# EAGLE schematic piezo-preamp-tickler_V2-RevX (EAGLE 8.3.2)

## Sheet 1 of 2
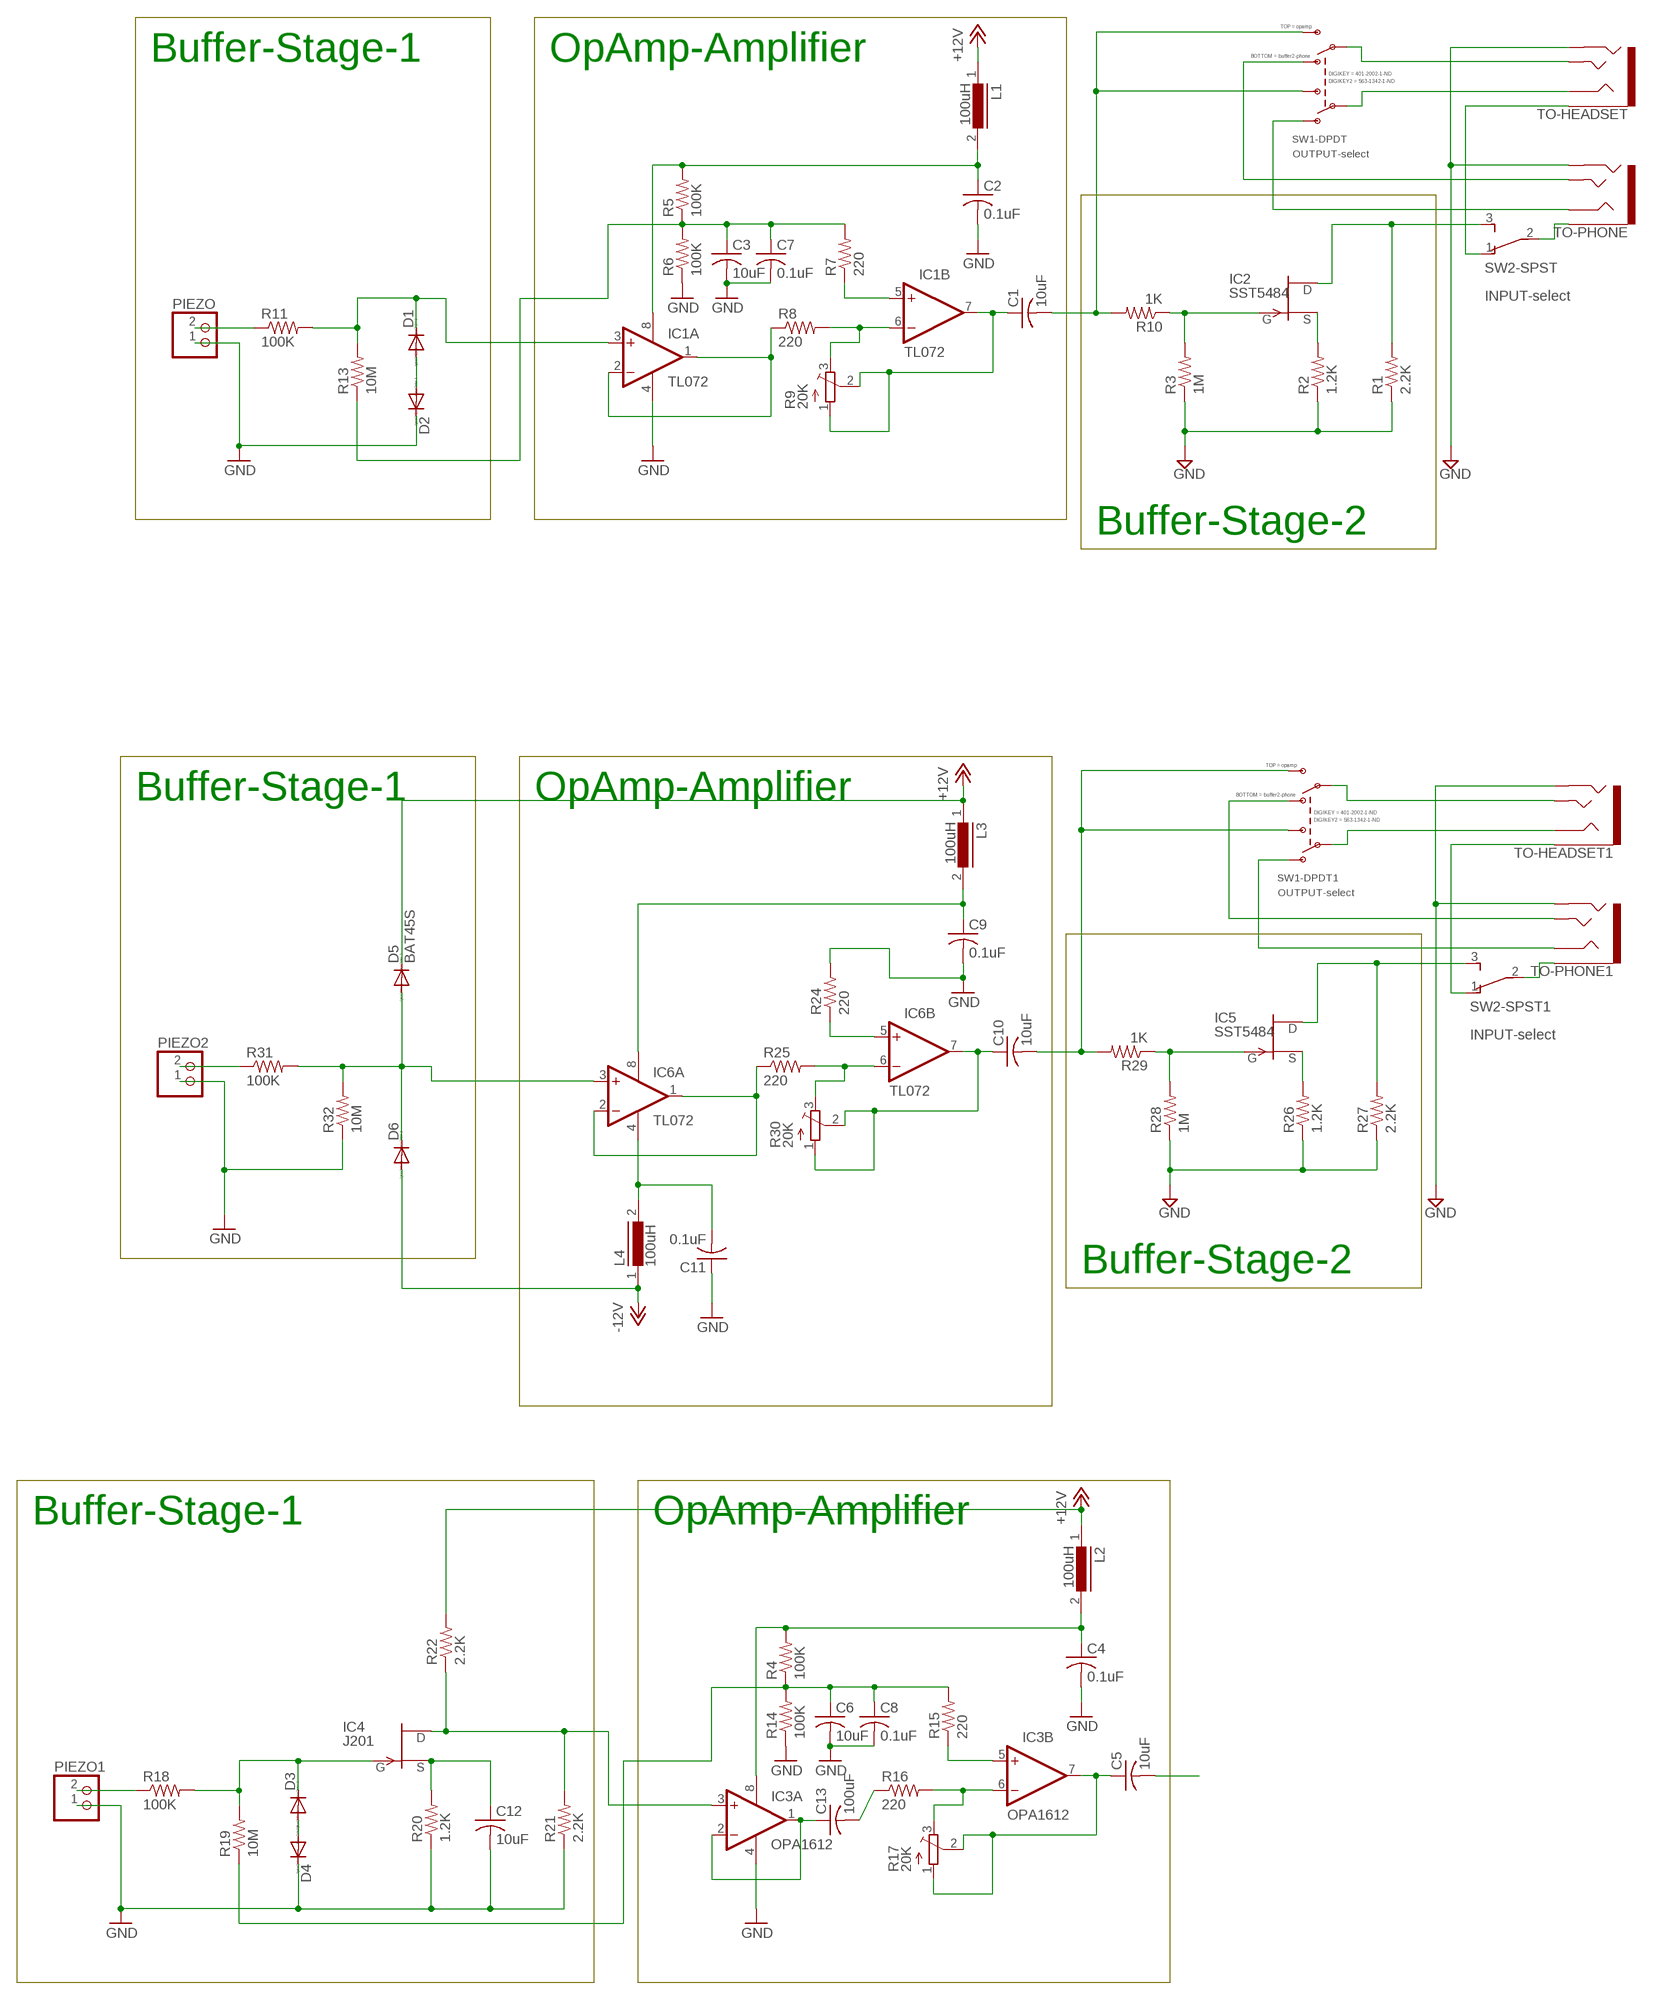
[diagram p0: schematic, sheet 1]

### Parts
C1  10uF  C-USC0805K  [C0805K]
C2  0.1uF  C-USC0805K  [C0805K]
C3  10uF  C-USC0805K  [C0805K]
C4  0.1uF  C-USC0805K  [C0805K]
C5  10uF  C-USC0805K  [C0805K]
C6  10uF  C-USC0805K  [C0805K]
C7  0.1uF  C-USC0805K  [C0805K]
C8  0.1uF  C-USC0805K  [C0805K]
C9  0.1uF  C-USC0805K  [C0805K]
C10  10uF  C-USC0805K  [C0805K]
C11  0.1uF  C-USC0805K  [C0805K]
C12  10uF  C-USC0805K  [C0805K]
C13  100uF  C-USC0805K  [C0805K]
D1  DIODE-SOD123  [SOD123]
D2  DIODE-SOD123  [SOD123]
D3  DIODE-SOD123  [SOD123]
D4  DIODE-SOD123  [SOD123]
D5  BAT45S  DIODE-SOD123  [SOD123]
D6  DIODE-SOD123  [SOD123]
IC1  TL072  OPA2134UA  [SO08]
IC2  SST5484  [SOT23]
IC3  OPA1612  OPA2134UA  [SO08]
IC4  J201  SST5484  [SOT23]
IC5  SST5484  [SOT23]
IC6  TL072  OPA2134UA  [SO08]
L1  100uH  LBC-SE  [LBC-SE]
L2  100uH  LBC-SE  [LBC-SE]
L3  100uH  LBC-SE  [LBC-SE]
L4  100uH  LBC-SE  [LBC-SE]
PIEZO  JST_2PIN-THM  [JST-PH-2-THM]
PIEZO1  JST_2PIN-THM  [JST-PH-2-THM]
PIEZO2  JST_2PIN-THM  [JST-PH-2-THM]
R1  2.2K  R-US_R0603  [R0603]
R2  1.2K  R-US_R0603  [R0603]
R3  1M  R-US_R0603  [R0603]
R4  100K  R-US_R0603  [R0603]
R5  100K  R-US_R0603  [R0603]
R6  100K  R-US_R0603  [R0603]
R7  220  R-US_R0603  [R0603]
R8  220  R-US_R0603  [R0603]
R9  20K  TRIMPOTTC33X  [TC33X]
R10  1K  R-US_R0603  [R0603]
R11  100K  R-US_R0603  [R0603]
R13  10M  R-US_R0603  [R0603]
R14  100K  R-US_R0603  [R0603]
R15  220  R-US_R0603  [R0603]
R16  220  R-US_R0603  [R0603]
R17  20K  TRIMPOTTC33X  [TC33X]
R18  100K  R-US_R0603  [R0603]
R19  10M  R-US_R0603  [R0603]
R20  1.2K  R-US_R0603  [R0603]
R21  2.2K  R-US_R0603  [R0603]
R22  2.2K  R-US_R0603  [R0603]
R24  220  R-US_R0603  [R0603]
R25  220  R-US_R0603  [R0603]
R26  1.2K  R-US_R0603  [R0603]
R27  2.2K  R-US_R0603  [R0603]
R28  1M  R-US_R0603  [R0603]
R29  1K  R-US_R0603  [R0603]
R30  20K  TRIMPOTTC33X  [TC33X]
R31  100K  R-US_R0603  [R0603]
R32  10M  R-US_R0603  [R0603]
SW1-DPDT  OUTPUT-select  SWITCH_DPDT  [DPDT_SMT_JS202011SCQN]
SW1-DPDT1  OUTPUT-select  SWITCH_DPDT  [DPDT_SMT_JS202011SCQN]
SW2-SPST  INPUT-select  SWITCH_SPDTTE-CONNECT  [SWITCH_SPDT-TE-CONNECT]
SW2-SPST1  INPUT-select  SWITCH_SPDTTE-CONNECT  [SWITCH_SPDT-TE-CONNECT]
TO-HEADSET  AUDIO-JACK3LGPADS  [AUDIO-JACK-TRRS-SMD]
TO-HEADSET1  AUDIO-JACK3LGPADS  [AUDIO-JACK-TRRS-SMD]
TO-PHONE  AUDIO-JACK3LGPADS  [AUDIO-JACK-TRRS-SMD]
TO-PHONE1  AUDIO-JACK3LGPADS  [AUDIO-JACK-TRRS-SMD]

### Nets
+12V: D5.C L1.1 L2.1 L3.1 R22.2 ; also sheet 2
-12V: D6.A L4.1
GND: C2.2 C3.2 C4.2 C6.2 C7.2 C8.2 C9.2 C11.1 C12.2 D2.C D4.C IC1.4(A:V-) IC3.4(A:V-) PIEZO1.1 PIEZO2.1 PIEZO.1 R1.1 R2.1 R3.1 R6.1 R14.1 R20.1 R21.1 R24.2 R26.1 R27.1 R28.1 R32.1 TO-HEADSET1.RING2 TO-HEADSET.RING2 TO-PHONE1.RING2 TO-PHONE.RING2 ; also sheet 2
N$1: C13.1 IC3.1(A:OUT) IC3.2(A:-IN)
N$2: PIEZO.2 R11.1
N$3: IC2.2(S) R2.2
N$5: IC1.5(B:+IN) R7.1
N$6: C2.1 IC1.8(A:V+) L1.2 R5.2
N$7: IC1.6(B:-IN) R8.2 R9.3(E)
N$8: D1.A D2.A
N$9: D1.C IC1.3(A:+IN) R11.2 R13.2
N$10: IC2.3(G) R3.2 R10.1
N$11: C1.2 R10.2 SW1-DPDT.P$3(S1) SW1-DPDT.P$4(S2)
N$12: SW2-SPST.1 TO-HEADSET.EARTH
N$13: SW1-DPDT.P$5(P2) TO-HEADSET.TIP
N$14: IC1.1(A:OUT) IC1.2(A:-IN) R8.1
N$15: SW1-DPDT.P$2(P1) TO-HEADSET.RING1
N$16: IC3.5(B:+IN) R15.1
N$17: SW2-SPST.2 TO-PHONE.EARTH
N$22: IC3.6(B:-IN) R16.2 R17.3(E)
N$23: C5.2
N$24: PIEZO1.2 R18.1
N$25: IC3.3(A:+IN) IC4.1(D) R21.2 R22.1
N$26: SW1-DPDT.P$1(O1) TO-PHONE.RING1
N$27: SW1-DPDT.P$6(O2) TO-PHONE.TIP
N$28: C3.1 C7.1 R5.1 R6.2 R7.2 R13.1
N$29: D3.A D4.A
N$30: IC5.2(S) R26.2
N$31: C5.1 IC3.7(B:OUT) R17.1(A) R17.2(S)
N$32: C4.1 IC3.8(A:V+) L2.2 R4.2
N$33: C12.1 IC4.2(S) R20.2
N$34: IC6.1(A:OUT) IC6.2(A:-IN) R25.1
N$35: C6.1 C8.1 R4.1 R14.2 R15.2 R19.1
N$36: D3.C IC4.3(G) R18.2 R19.2
N$37: IC6.5(B:+IN) R24.1
N$38: IC6.6(B:-IN) R25.2 R30.3(E)
N$39: IC5.3(G) R28.2 R29.1
N$41: C1.1 IC1.7(B:OUT) R9.1(A) R9.2(S)
N$42: C10.2 R29.2 SW1-DPDT1.P$3(S1) SW1-DPDT1.P$4(S2)
N$43: SW2-SPST1.1 TO-HEADSET1.EARTH
N$44: SW1-DPDT1.P$5(P2) TO-HEADSET1.TIP
N$45: SW1-DPDT1.P$2(P1) TO-HEADSET1.RING1
N$46: SW2-SPST1.2 TO-PHONE1.EARTH
N$47: PIEZO2.2 R31.1
N$48: SW1-DPDT1.P$1(O1) TO-PHONE1.RING1
N$49: SW1-DPDT1.P$6(O2) TO-PHONE1.TIP
N$50: C11.2 IC6.4(A:V-) L4.2
N$52: C13.2 R16.1
N$53: C10.1 IC6.7(B:OUT) R30.1(A) R30.2(S)
N$54: C9.1 IC6.8(A:V+) L3.2
N$55: D5.A D6.C IC6.3(A:+IN) R31.2 R32.2
SELECT: IC2.1(D) R1.2 SW2-SPST.3
SELECT1: IC5.1(D) R27.2 SW2-SPST1.3

### Notes on the sheet
- Buffer-Stage-1 | OpAmp-Amplifier
- Buffer-Stage-2
- Buffer-Stage-1 | OpAmp-Amplifier
- Buffer-Stage-2
- Buffer-Stage-1 | OpAmp-Amplifier

## Sheet 2 of 2
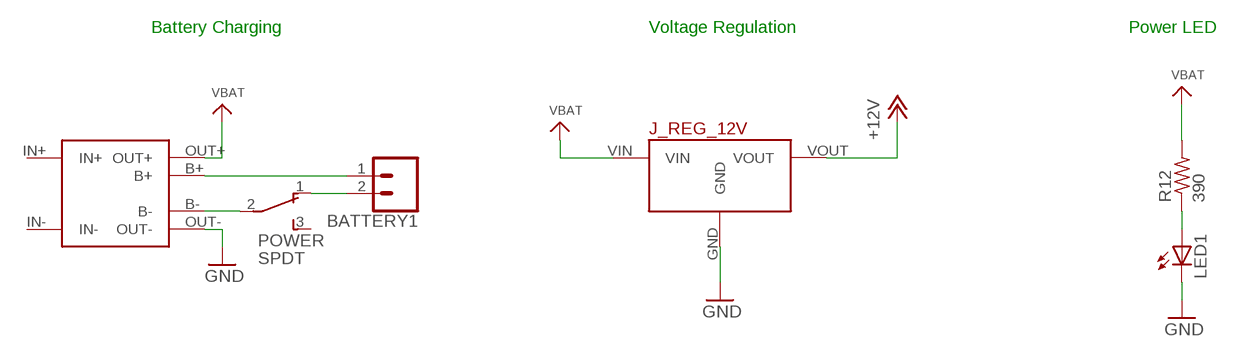
[diagram p1: schematic, sheet 2]

### Parts
BATTERY1  CONN_02LOCK  [1X02_LOCK]
J_REG_12V  POLOLU_VOLTAGE_REGULATORS_3PIN  [POLOLU_5V-12V_STEPUP_U3V12F5-U3V12F12]
LED1  LED3MM  [LED3MM]
POWER  SPDT  SWITCH_SPDTTE-CONNECT  [SWITCH_SPDT-TE-CONNECT]
R12  390  R-US_R0805  [R0805]
USB-LIPO-CHARGER  TP4056-MODULE  [TP4056-LITHIUM-PROTECTED-MODULE]

### Nets
+12V: J_REG_12V.VOUT ; also sheet 1
GND: J_REG_12V.GND LED1.K(C) USB-LIPO-CHARGER.OUT- ; also sheet 1
N$18: LED1.A R12.1
N$19: BATTERY1.1 USB-LIPO-CHARGER.B+
N$20: POWER.2 USB-LIPO-CHARGER.B-
N$21: BATTERY1.2 POWER.1
VBAT: J_REG_12V.VIN R12.2 USB-LIPO-CHARGER.OUT+
Unconnected: POWER.3

### Notes on the sheet
- Battery Charging | Voltage Regulation | Power LED

## Power pins joined to a net without a drawn wire
IN+: USB-LIPO-CHARGER.IN+
IN-: USB-LIPO-CHARGER.IN-

## Library data of the parts
BATTERY1 = SparkFun-Connectors:CONN_02: Multi connection point. Often used as Generic Header-pin footprint for 0.1 inch spaced/style header connections On any of the 0.1 inch spaced packages, you can populate with these: Break Away Headers - Straight <https://www.sparkfun.com/products/116> (PRT-00116) Break Away Male Headers - Right Angle <https://www.sparkfun.com/products/553> (PRT-00553) Female Headers <https://www.sparkfun.com/products/115> (PRT-00115) Break Away Headers - Machine Pin <https://www.sparkfun.com/products/117> (PRT-00117) Break Away Female Headers - Swiss Machine Pin <https://www.sparkfun.com/products/743> (PRT-00743) For SCREWTERMINALS and SPRING TERMINALS visit here: Screw Terimnals on SparkFun.com <https://www.sparkfun.com/search/results?term=Screw+Terminals> (5mm/3.5mm/2.54mm spacing) This device is also useful as a general connection point to wire up your design to another part of your project. Our various solder wires solder well into these plated through hole pads. Hook-Up Wire - Assortment (Stranded, 22 AWG) <https://www.sparkfun.com/products/11375> (PRT-11375) Hook-Up Wire - Assortment (Solid Core, 22 AWG) <https://www.sparkfun.com/products/11367> (PRT-11367) View the entire wire category on our website here <https://www.sparkfun.com/categories/141> Special notes: Molex polarized connector foot print use with: PRT-08233 with associated crimp pins and housings. 2.54_SCREWTERM for use with PRT-10571. 3.5mm Screw Terminal footprints for PRT-08084 5mm Screw Terminal footprints for use with PRT-08432
C1-C13 = adafruit:C-US: CAPACITOR, American symbol
D1-D6 = diode:DIODE-: DIODE
IC1 IC3 IC6 = linear:OPA2*: Dual Operational Amplifier Low Power, Single-Supply, Rail-To-Rail Operational Amplifier Source: http://focus.ti.com/lit/ds/symlink/opa2345.pdf http://focus.ti.com .. opa241.pdf http://focus.ti.com/lit/ds/symlink/opa2134.pdf
IC2 IC4 IC5 = transistor-fet:?548*: N-Channel JFETs Source: VISHAY 2N5484.pdf Compatible: TO92 2N5245 J304 J305 U310 J308 J309 J310 TO72 2N4416 2N4416A 2N3823 2N4351 3N169 3N170 3N171 MFE3002 TO18 2N3796 2N3797 MFE825 Source: Motorola European Master Guide Pacge 3-59
J_REG_12V = CMU-ArtFab:POLOLU_VOLTAGE_REGULATORS_3PIN: Polulu 5V Step-Up/Step-Down Voltage REgulator S7V7F5
L1-L4 = inductors:LBC-SE: INDUCTOR
LED1 = led:LED: LED OSRAM: - CHIPLED LG R971, LG N971, LY N971, LG Q971, LY Q971, LO R971, LY R971 LH N974, LH R974 LS Q976, LO Q976, LY Q976 LO Q996 - Hyper CHIPLED LW Q18S LB Q993, LB Q99A, LB R99A - SideLED LS A670, LO A670, LY A670, LG A670, LP A670 LB A673, LV A673, LT A673, LW A673 LH A674 LY A675 LS A676, LA A676, LO A676, LY A676, LW A676 LS A679, LY A679, LG A679 - Hyper Micro SIDELED® LS Y876, LA Y876, LO Y876, LY Y876 LT Y87S - SmartLED LW L88C, LW L88S LB L89C, LB L89S, LG L890 LS L89K, LO L89K, LY L89K LS L896, LA L896, LO L896, LY L896 - TOPLED LS T670, LO T670, LY T670, LG T670, LP T670 LSG T670, LSP T670, LSY T670, LOP T670, LYG T670 LG T671, LOG T671, LSG T671 LB T673, LV T673, LT T673, LW T673 LH T674 LS T676, LA T676, LO T676, LY T676, LB T676, LH T676, LSB T676, LW T676 LB T67C, LV T67C, LT T67C, LS T67K, LO T67K, LY T67K, LW E67C LS E67B, LA E67B, LO E67B, LY E67B, LB E67C, LV E67C, LT E67C LW T67C LS T679, LY T679, LG T679 LS T770, LO T770, LY T770, LG T770, LP T770 LB T773, LV T773, LT T773, LW T773 LH T774 LS E675, LA E675, LY E675, LS T675 LS T776, LA T776, LO T776, LY T776, LB T776 LHGB T686 LT T68C, LB T68C - Hyper Mini TOPLED® LB M676 - Mini TOPLED Santana® LG M470 LS M47K, LO M47K, LY M47K Source: http://www.osram.convergy.de LUXEON: - LUMILED® LXK2-PW12-R00, LXK2-PW12-S00, LXK2-PW14-U00, LXK2-PW14-V00 LXK2-PM12-R00, LXK2-PM12-S00, LXK2-PM14-U00 LXK2-PE12-Q00, LXK2-PE12-R00, LXK2-PE12-S00, LXK2-PE14-T00, LXK2-PE14-U00 LXK2-PB12-K00, LXK2-PB12-L00, LXK2-PB12-M00, LXK2-PB14-N00, LXK2-PB14-P00, LXK2-PB14-Q00 LXK2-PR12-L00, LXK2-PR12-M00, LXK2-PR14-Q00, LXK2-PR14-R00 LXK2-PD12-Q00, LXK2-PD12-R00, LXK2-PD12-S00 LXK2-PH12-R00, LXK2-PH12-S00 LXK2-PL12-P00, LXK2-PL12-Q00, LXK2-PL12-R00 Source: www.luxeon.com KINGBRIGHT: KA-3528ASYC Source: www.kingbright.com
PIEZO PIEZO1 PIEZO2 = adafruit:JST_2PIN: JST 2-Pin Connectors of various flavors SMT-RA (S2B-PH-SM4) 4UConnector #17311 SMT (B2B-PH-SM4) THM-RA (S2B-PH) THM (B2B-PH)
POWER SW2-SPST SW2-SPST1 = CMU-ArtFab:SWITCH_SPDT
R1-R8 R10-R16 R18-R22 R24-R29 R31 R32 = CMU-ArtFab:R-US_: RESISTOR, American symbol
R9 R17 R30 = adafruit:TRIMPOT: SMT trimmer potentiometer part number TC33X http://www.ladyada.net/library/eagle
SW1-DPDT SW1-DPDT1 = microbuilder:SWITCH_DPDT: Switch - DPDT A DPDT Switch acts like an SPDT switch, but has a pair of switches instead of just one. Vertical - 0.3A @ 6V SMT - Digikey: JS202011SCQN; BOTTOM: buffer2-phone; DIGIKEY: 401-2002-1-ND; DIGIKEY2: 563-1342-1-ND; TOP: opamp
TO-HEADSET TO-HEADSET1 TO-PHONE TO-PHONE1 = Daniel:AUDIO-JACK3: Audio jack - 3.5mm TRRS variety - two rings.
USB-LIPO-CHARGER = CMU-ArtFab:TP4056-MODULE

## Net classes
0 default: width 0.152 mm, clearance 0.2 mm